# Altium schematic sheet DDS_Out.SchDoc
size A4; DrawnBy: Marin Sinožić; SheetNumber: 5; SheetTotal: 6
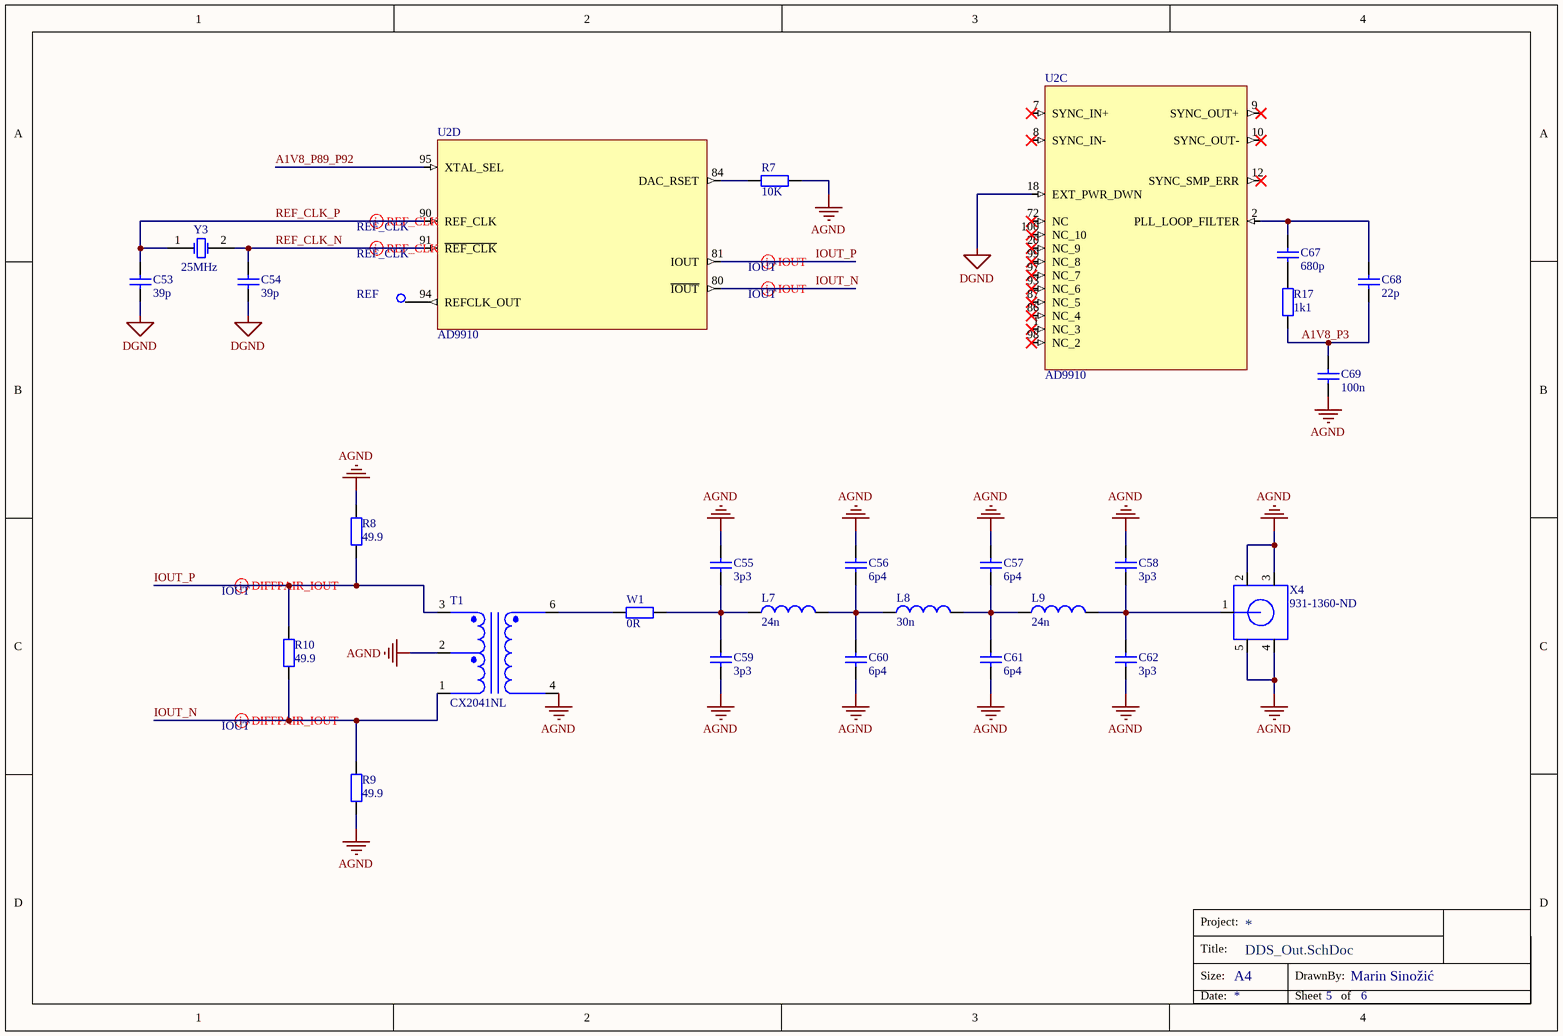
[diagram p0: DDS_Out.SchDoc]

## Parts
C53  39p  [0603]
C54  39p  [0603]
C55  3p3  [0603]
C56  6p4  [0603]
C57  6p4  [0603]
C58  3p3  [0603]
C59  3p3  [0603]
C60  6p4  [0603]
C61  6p4  [0603]
C62  3p3  [0603]
C67  680p  [0603]
C68  22p  [0603]
C69  100n  [0603]
L7  24n  [0603]
L8  30n  [0603]
L9  24n  [0603]
R7  10K  [0603]
R8  49.9  [0805]
R9  49.9  [0805]
R10  49.9  [0805]
R17  Resistance: 1k1  [0603]  (hidden comment: TBD)
REF  TestPoint  [TP]  (value not drawn)
T1  CX2041NL  [RF_TRANSF]
U2  AD9910  [TSQFP50P1600X1600X105_HS-101N]  (parts C,D of 5)
W1  0R  [0603]
X4  931-1360-ND  [SMA]
Y3  25MHz  [XTAL_ECS-196-S-23A-TR]

## Nets
AGND: C55.2 C56.2 C57.2 C58.2 C59.1 C60.1 C61.1 C62.1 C69.1 R7.1 R8.1 R9.2 T1.2 T1.4 X4.2(GND) X4.3(GND) X4.4(GND) X4.5(GND)
DGND: C53.1 C54.1 U2.18(EXT_PWR_DWN)
A1V8_P3: C68.1 C69.2 R17.2
A1V8_P89_P92: U2.95(XTAL_SEL)
IOUT_N: R9.1 R10.2 T1.1 U2.80(~{IOUT})
IOUT_P: R8.2 R10.1 T1.3 U2.81(IOUT)
REF_CLK_N: C54.2 U2.91(~{REF_CLK}) Y3.2(OSC2)
REF_CLK_P: C53.2 U2.90(REF_CLK) Y3.1(OSC1)
NetC55_1: C55.1 C59.2 L7.1 W1.2
NetC56_1: C56.1 C60.2 L7.2 L8.1
NetC57_1: C57.1 C61.2 L8.2 L9.1
NetC58_1: C58.1 C62.2 L9.2 X4.1(OUT)
NetC67_1: C67.1 R17.1
NetC67_2: C67.2 C68.2 U2.2(PLL_LOOP_FILTER)
NetR7_2: R7.2 U2.84(DAC_RSET)
NetREF_1: REF.1 U2.94(REFCLK_OUT)
NetT1_6: T1.6 W1.1

Not connected (* = marked no-connect by the designer): U2 1(NC_3)* 7(SYNC_IN+)* 8(SYNC_IN-)* 9(SYNC_OUT+)* 10(SYNC_OUT-)* 12(SYNC_SMP_ERR)* 20(NC_9)* 72(NC)* 86(NC_4)* 87(NC_5)* 93(NC_6)* 97(NC_7)* 98(NC_2)* 99(NC_8)* 100(NC_10)*

## Layout directives
differential pair; differential pair class IOUT: IOUT_N, IOUT_P
differential pair; differential pair class REF_CLK; rule Matched Net Lengths [Tolerance = 0.01mm]: REF_CLK_P
differential pair; differential pair class REF_CLK: REF_CLK_N

## Notes on the sheet
- Project:
- Title:
- Size:
- A4
- DrawnBy:
- Date:
- Sheet
- of

## Library data of the parts
C53 C54 = Cap: CAP CER 39PF 50V C0G/NP0 0603; Manufacturer Part Number: 720-VJ0603A390GXACW1BCCT-ND; Value: 39p; Supplier 1: Digi-Key; Price: 0.15
C55 C58 C59 C62 = C_0402_3.3pF: CAP CER 3.3PF 50V C0G/NPO 0603; Manufacturer Part Number: 311-3832-1-ND; Supplier 1: Digi-Key; Capacitance: 3.3pF; Price: 0.11; Value: 3p3
C56 C57 C60 C61 C67-C69 = C_0402_6.8pF: CAP CER RF 6.4PF 50V +/-0.1 PF C; Manufacturer Part Number: 399-16225-1-ND; Supplier 1: Digi-Key; Price: 0.30
  C56 C57 C60 C61: Capacitance: 6.4pF; Value: 6p4
  C67: Capacitance: 680p; Value: 680p
  C68: Capacitance: 6.4pF; Value: 22p
  C69: Capacitance: 6.4pF; Value: 100n
L7 L9 = L_0402_24nH: FIXED IND 24NH 500MA 210MOHM SMD; Manufacturer Part Number: 490-6877-1-ND; Supplier 1: Digi-Key; Inductance: 24nH; Price: 0.18; Value: 24n
L8 = L_0402_30nH: FIXED IND 30NH 600MA 144MOHM SMD; Manufacturer Part Number: 490-15816-1-ND; Supplier 1: Digi-Key; Inductance: 30nH; Price: 0.25; Value: 30n
R7 = Res2: RES SMD 10K OHM 0.5% 1/5W 0603; Manufacturer Part Number: P20397CT-ND; Value: 10K; Supplier 1: Digi-Key; Price: 0.16
R8-R10 = Res2: RES SMD 49.9 OHM 0.1% 1/10W 0603; Manufacturer Part Number: P49.9DBCT-ND; Value: 49.9; Supplier 1: Digi-Key; Price: 0.32
R17 W1 = R_0603_0ohm: RES SMD 0 OHM JUMPER 1/3W 0603; Manufacturer Part Number: 541-0.0SBCT-ND; Supplier 1: Digi-Key; Price: 0.14
  W1: Resistance: 0R
T1 = RF_TRANSF: BALUN 50KHZ-450MHZ 75/75 5SMD; Manufacturer Part Number: 553-3187-ND; Supplier 1: Digi-Key; Price: 2.91
U2 = AD9910BSVZ: ANALOG DEVICES - AD9910BSVZ - Direct Digital Synthesizer, 1 GSPS. 14 Bit, 3.3 V,; Manufacturer Part Number: 505-AD9910BSVZ-ND; Price: 72.64; Supplier 1: Digi-Key
X4 = SMA_JACK: CONN RP-SMA JACK R/A 50 OHM PCB; Supplier 1: Digi-Key; Manufacturer Part Number: 931-1360-ND; Price: 3.10
Y3 = XTAL: Crystal 25.0MHZ 20PF SMD; Manufacturer Part Number: 50-ECS-250-20-23A-EN-TRCT-ND; Price: 1.01; Supplier 1: Digi-Key